# EAGLE design VIVA Blue Screen REV1 (EAGLE 6.3)

## Sheet 1 of 2
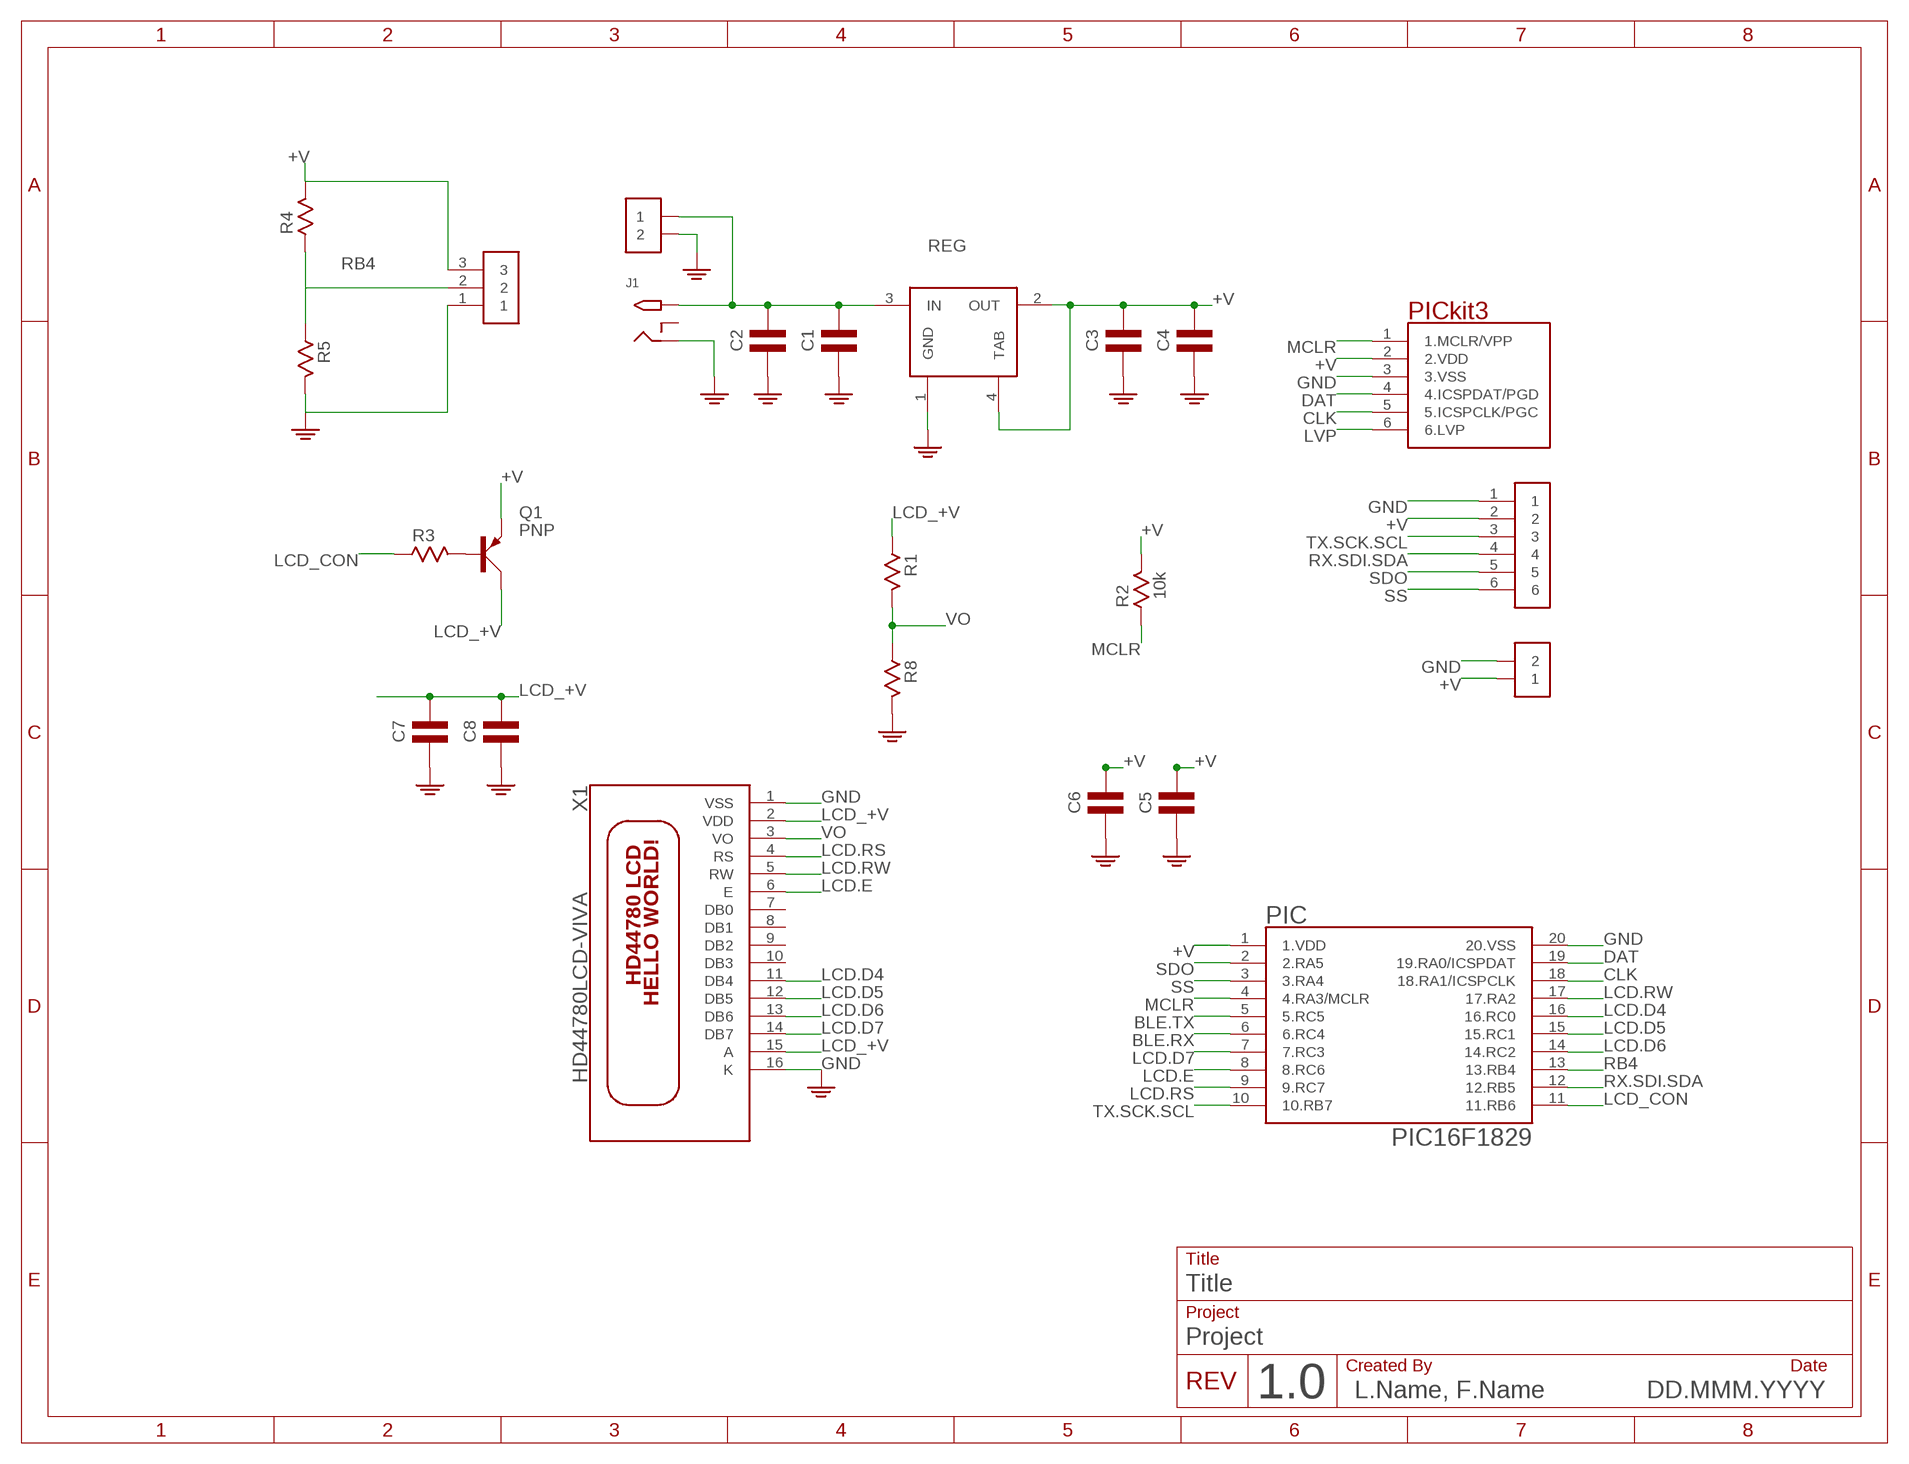
[diagram p0: schematic, sheet 1]

### Parts
C1  C0805  [C0805]
C2  C0805  [C0805]
C3  C0805  [C0805]
C4  C0805  [C0805]
C5  C0805  [C0805]
C6  C0805  [C0805]
C7  C0805  [C0805]
C8  C0805  [C0805]
J1  2.1MMJACKTHM  [PJ-102A]
J3  PICKIT3  [PINS_6_PICKIT3]
PIC  PIC16F1829  [SOP20-NEW]
Q1  PNP  2N3906SOT23  [SOT23]
R1  R0805  [R0805]
R2  10k  R0805  [R0805]
R3  R0805  [R0805]
R4  R0805  [R0805]
R5  R0805  [R0805]
R8  R0805  [R0805]
REG  REGULATOR_SCHSOT223  [SOT223]
U$1  PINS_3  [PINS_3]
U$2  PCB_2  [PCB_2]
U$3  PINS_6SQUARE  [PINS_6]
U$9  PCB_2  [PCB_2]
X1  HD44780LCD-VIVA  [LCD1602-VIVA]

### Nets
+V: C3.2 C4.2 C5.2 C6.2 J3.2(2.VDD) PIC.1(1.VDD) Q1.2(E) R2.2 R4.2 REG.2(OUT) REG.4(TAB) U$1.3 U$3.2 U$9.P$1 ; also sheet 2
BLE.RX: PIC.6(6.RC4) ; also sheet 2
BLE.TX: PIC.5(5.RC5) ; also sheet 2
CLK: J3.5(5.ICSPCLK/PGC) PIC.18(18.RA1/ICSPCLK)
DAT: J3.4(4.ICSPDAT/PGD) PIC.19(19.RA0/ICSPDAT)
GND: C1.1 C2.1 C3.1 C4.1 C5.1 C6.1 C7.1 C8.1 J1.RING J3.3(3.VSS) PIC.20(20.VSS) R5.2 R8.2 REG.1(GND) U$1.1 U$2.P$3 U$3.1 U$9.P$3 X1.1(VSS) X1.16(K) ; also sheet 2
LCD.D4: PIC.16(16.RC0) X1.11(DB4)
LCD.D5: PIC.15(15.RC1) X1.12(DB5)
LCD.D6: PIC.14(14.RC2) X1.13(DB6)
LCD.D7: PIC.7(7.RC3) X1.14(DB7)
LCD.E: PIC.8(8.RC6) X1.6(E)
LCD.RS: PIC.9(9.RC7) X1.4(RS)
LCD.RW: PIC.17(17.RA2) X1.5(RW)
LCD_+V: C7.2 C8.2 Q1.3(C) R1.1 X1.2(VDD) X1.15(A)
LCD_CON: PIC.11(11.RB6) R3.1
LVP: J3.6(6.LVP)
MCLR: J3.1(1.MCLR/VPP) PIC.4(4.RA3/MCLR) R2.1
N$2: C1.2 C2.2 J1.TIP REG.3(IN) U$2.P$1
N$4: Q1.1(B) R3.2
RB4: PIC.13(13.RB4) R4.1 R5.1 U$1.2
RX.SDI.SDA: PIC.12(12.RB5) U$3.4
SDO: PIC.2(2.RA5) U$3.5
SS: PIC.3(3.RA4) U$3.6
TX.SCK.SCL: PIC.10(10.RB7) U$3.3
VO: R1.2 R8.1 X1.3(VO)
Unconnected: J1.RING_SW X1.7(DB0) X1.8(DB1) X1.9(DB2) X1.10(DB3)

### Notes on the sheet
- Title
- Title
- Project
- Project
- Created By | Date
- DD.MMM.YYYY
- REV
- 1.0 | L.Name, F.Name

## Sheet 2 of 2
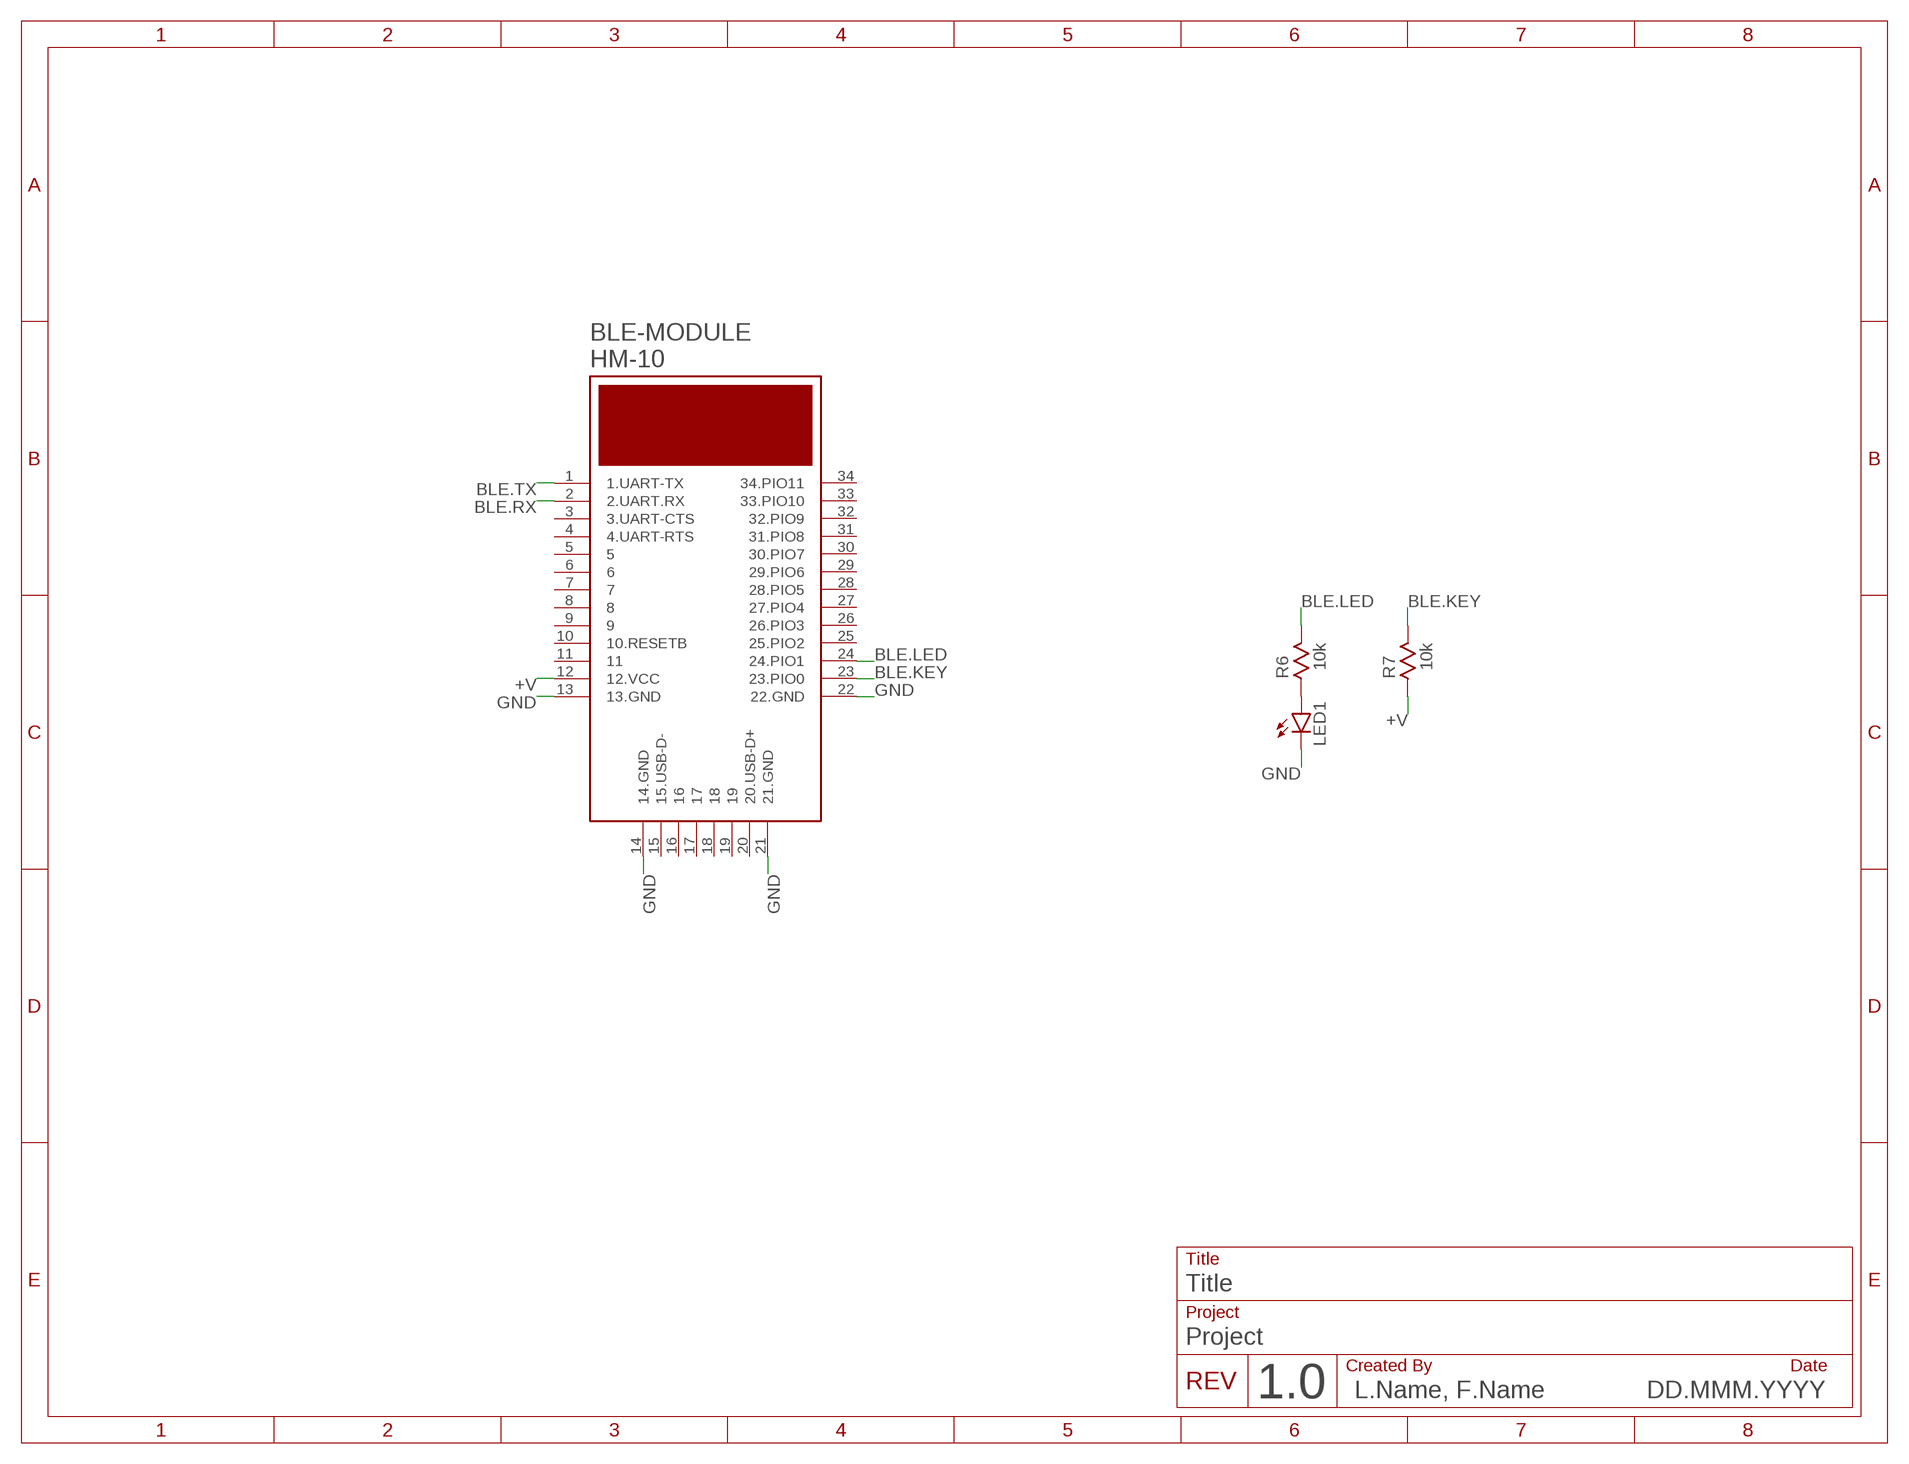
[diagram p1: schematic, sheet 2]

### Parts
BLE-MODULE  HM-10  HM-10SMD  [HM-10]
LED1  LEDCHIP-LED0805  [CHIP-LED0805]
R6  10k  R0805  [R0805]
R7  10k  R0805  [R0805]

### Nets
+V: BLE-MODULE.12(12.VCC) R7.1 ; also sheet 1
BLE.KEY: BLE-MODULE.23(23.PIO0) R7.2
BLE.LED: BLE-MODULE.24(24.PIO1) R6.2
BLE.RX: BLE-MODULE.2(2.UART.RX) ; also sheet 1
BLE.TX: BLE-MODULE.1(1.UART-TX) ; also sheet 1
GND: BLE-MODULE.13(13.GND) BLE-MODULE.14(14.GND) BLE-MODULE.21(21.GND) BLE-MODULE.22(22.GND) LED1.C ; also sheet 1
N$3: LED1.A R6.1
Unconnected: BLE-MODULE.3(3.UART-CTS) BLE-MODULE.4(4.UART-RTS) BLE-MODULE.5 BLE-MODULE.6 BLE-MODULE.7 BLE-MODULE.8 BLE-MODULE.9 BLE-MODULE.10(10.RESETB) BLE-MODULE.11 BLE-MODULE.15(15.USB-D-) BLE-MODULE.16 BLE-MODULE.17 BLE-MODULE.18 BLE-MODULE.19 BLE-MODULE.20(20.USB-D+) BLE-MODULE.25(25.PIO2) BLE-MODULE.26(26.PIO3) BLE-MODULE.27(27.PIO4) BLE-MODULE.28(28.PIO5) BLE-MODULE.29(29.PIO6) BLE-MODULE.30(30.PIO7) BLE-MODULE.31(31.PIO8) BLE-MODULE.32(32.PIO9) BLE-MODULE.33(33.PIO10) BLE-MODULE.34(34.PIO11)

### Notes on the sheet
- Title
- Title
- Project
- Project
- Created By | Date
- DD.MMM.YYYY
- REV
- 1.0 | L.Name, F.Name

## Library data of the parts
BLE-MODULE = nolan-utsa:HM-10
C1-C8 = nolan-utsa:C
J1 = nolan-utsa:2.1MMJACK: 2.1mm x 5.5mm THM DC jack with internal switch. Digikey part #PJ-102A, 4UCON part #05537 2.1mm x 5.5mm SMT DC jack with internal switch. Digikey part #PJ-002A-SMT, 4UCON part #03267 By microbuilder.eu & adafruit.com
J3 = nolan-utsa:PICKIT3
LED1 = nolan-utsa:LED: LED OSRAM: - CHIPLED LG R971, LG N971, LY N971, LG Q971, LY Q971, LO R971, LY R971 LH N974, LH R974 LS Q976, LO Q976, LY Q976 LO Q996 - Hyper CHIPLED LW Q18S LB Q993, LB Q99A, LB R99A - SideLED LS A670, LO A670, LY A670, LG A670, LP A670 LB A673, LV A673, LT A673, LW A673 LH A674 LY A675 LS A676, LA A676, LO A676, LY A676, LW A676 LS A679, LY A679, LG A679 - Hyper Micro SIDELED® LS Y876, LA Y876, LO Y876, LY Y876 LT Y87S - SmartLED LW L88C, LW L88S LB L89C, LB L89S, LG L890 LS L89K, LO L89K, LY L89K LS L896, LA L896, LO L896, LY L896 - TOPLED LS T670, LO T670, LY T670, LG T670, LP T670 LSG T670, LSP T670, LSY T670, LOP T670, LYG T670 LG T671, LOG T671, LSG T671 LB T673, LV T673, LT T673, LW T673 LH T674 LS T676, LA T676, LO T676, LY T676, LB T676, LH T676, LSB T676, LW T676 LB T67C, LV T67C, LT T67C, LS T67K, LO T67K, LY T67K, LW E67C LS E67B, LA E67B, LO E67B, LY E67B, LB E67C, LV E67C, LT E67C LW T67C LS T679, LY T679, LG T679 LS T770, LO T770, LY T770, LG T770, LP T770 LB T773, LV T773, LT T773, LW T773 LH T774 LS E675, LA E675, LY E675, LS T675 LS T776, LA T776, LO T776, LY T776, LB T776 LHGB T686 LT T68C, LB T68C - Hyper Mini TOPLED® LB M676 - Mini TOPLED Santana® LG M470 LS M47K, LO M47K, LY M47K Source: http://www.osram.convergy.de LUXEON: - LUMILED® LXK2-PW12-R00, LXK2-PW12-S00, LXK2-PW14-U00, LXK2-PW14-V00 LXK2-PM12-R00, LXK2-PM12-S00, LXK2-PM14-U00 LXK2-PE12-Q00, LXK2-PE12-R00, LXK2-PE12-S00, LXK2-PE14-T00, LXK2-PE14-U00 LXK2-PB12-K00, LXK2-PB12-L00, LXK2-PB12-M00, LXK2-PB14-N00, LXK2-PB14-P00, LXK2-PB14-Q00 LXK2-PR12-L00, LXK2-PR12-M00, LXK2-PR14-Q00, LXK2-PR14-R00 LXK2-PD12-Q00, LXK2-PD12-R00, LXK2-PD12-S00 LXK2-PH12-R00, LXK2-PH12-S00 LXK2-PL12-P00, LXK2-PL12-Q00, LXK2-PL12-R00 Source: www.luxeon.com KINGBRIGHT: KA-3528ASYC Source: www.kingbright.com
PIC = nolan-utsa:PIC16F1829
Q1 = nolan-utsa:2N3906: PNP TRANSISTOR
R1-R8 = nolan-utsa:R
REG = nolan-utsa:REGULATOR_SCH
U$1 = nolan-utsa:PINS_3
U$2 U$9 = nolan-utsa:PCB_2
U$3 = nolan-utsa:PINS_6
X1 = nolan-utsa:HD44780LCD: HD44780 LCD Standard character type LCDs, available in sizes from 8x1 to 40x4!

## Board
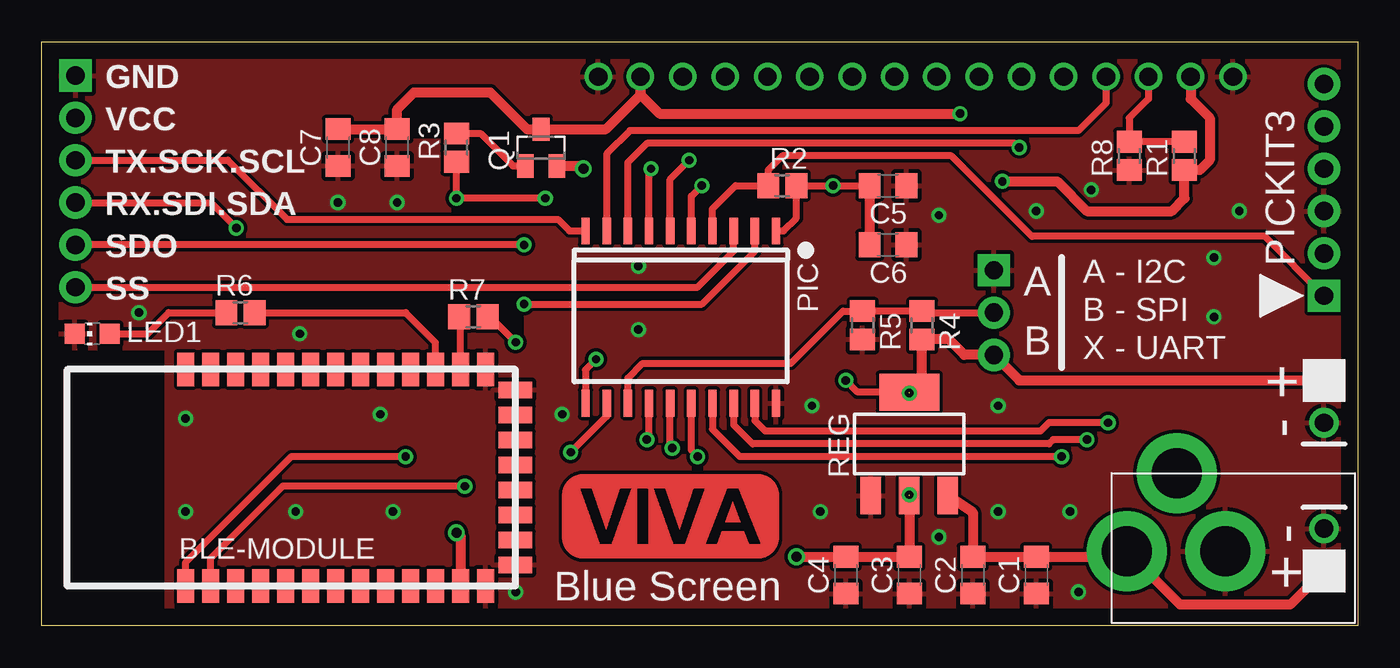
[diagram p2: board, top side]
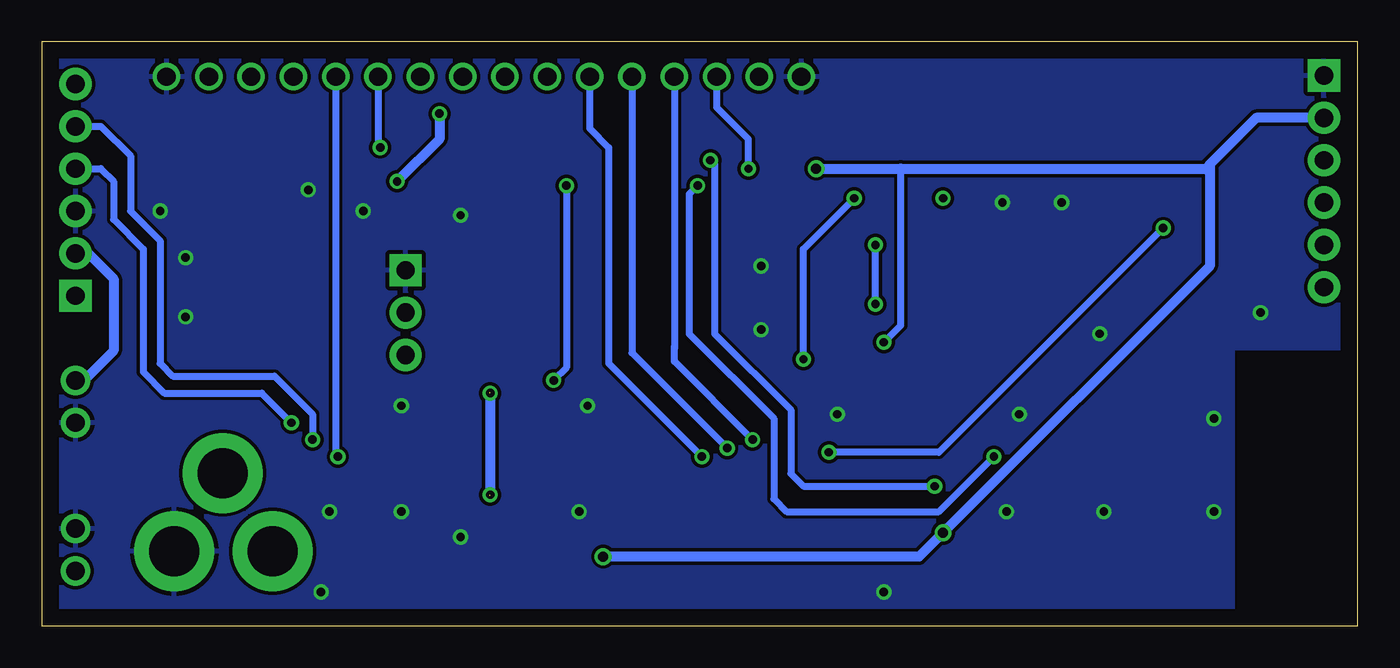
[diagram p3: board, bottom side, seen from below]

Size 78.99 x 35.05 mm. Coordinates in mm from the lower left corner, seen from the top.
Outline: 78.99,0 0,0 0,35.05 78.99,35.05 78.99,0
Copper layers (1*16): Top 0.035mm / dielectric 1.5mm / Bottom 0.035mm
Design rules "default *": minimum track width 10mil, minimum drill 24mil, track to track 8mil, track to pad 8mil, pad to pad 8mil, via to via 8mil, smd to smd 8mil, copper to edge 40mil, drill to drill 8mil, minimum pad ring 10mil, minimum via ring 8mil, stop-mask expansion 4mil, vias tented up to drill 20mil, thermal gap 10mil
tRestrict: 3 lines

### Footprints (pad centres in the part's own frame; a part is rotated, then mirrored left to right if it is on the bottom)
HM-10 = smd 2 x 1: 1 -6.5,6.34; 2 -6.5,4.84; 3 -6.5,3.34; 4 -6.5,1.84; 5 -6.5,0.34; 6 -6.5,-1.16; 7 -6.5,-2.66; 8 -6.5,-4.16; 9 -6.5,-5.66; 10 -6.5,-7.16; 11 -6.5,-8.66; 12 -6.5,-10.16; 13 -6.5,-11.66; 22 6.5,-11.66; 23 6.5,-10.16; 24 6.5,-8.66; 25 6.5,-7.16; 26 6.5,-5.66; 27 6.5,-4.16; 28 6.5,-2.66; 29 6.5,-1.16; 30 6.5,0.34; 31 6.5,1.84; 32 6.5,3.34; 33 6.5,4.84; 34 6.5,6.34 | smd 1 x 2: 14 -5.23,-13.45; 15 -3.73,-13.45; 16 -2.23,-13.45; 17 -0.73,-13.45; 18 0.77,-13.45; 19 2.27,-13.45; 20 3.77,-13.45; 21 5.27,-13.45
C0805 = smd 1.3 x 1.5: 1 -1.104,0; 2 1.104,0
PJ-102A = drill 3 pad 4.8: RING 0.1,-3.39; RING_SW -4.6,-6.29; TIP 0.1,-9.29
PINS_6_PICKIT3 = drill 1.1 pad 1.93 square: 1 0,0 | drill 1.1 pad 1.93: 2 0,-2.54; 3 0,-5.08; 4 0,-7.62; 5 0,-10.16; 6 0,-12.7
CHIP-LED0805 = smd 1.2 x 1.2: A 0,-1.05; C 0,1.05
SOP20-NEW = smd 0.5 x 1.6: 1 -5.715,-5.152; 2 -4.445,-5.152; 3 -3.175,-5.152; 4 -1.905,-5.152; 5 -0.635,-5.152; 6 0.635,-5.152; 7 1.905,-5.152; 8 3.175,-5.152; 9 4.445,-5.152; 10 5.715,-5.152; 11 5.715,5.188; 12 4.445,5.188; 13 3.175,5.188; 14 1.905,5.188; 15 0.635,5.188; 16 -0.635,5.188; 17 -1.905,5.188; 18 -3.175,5.188; 19 -4.445,5.188; 20 -5.715,5.188
SOT23 = smd 1 x 1.4: 1 -0.95,-1.1; 2 0.95,-1.1; 3 0,1.1
R0805 = smd 1.3 x 1.5: 1 -0.85,0; 2 0.85,0
SOT223 = smd 1.219 x 2.235: 1 -2.311,-3.099; 2 0,-3.099; 3 2.311,-3.099 | smd 3.6 x 2.2: 4 0,3.099
PINS_3 = drill 1.1 pad 1.93 square: 1 0,0 | drill 1.1 pad 1.93: 2 2.54,0; 3 5.08,0
PCB_2 = drill 1.1 pad 1.778: P$1 0,0; P$3 0,-2.54
PINS_6 = drill 1.1 pad 1.93 square: 1 0,0 | drill 1.1 pad 1.93: 2 2.54,0; 3 5.08,0; 4 7.62,0; 5 10.16,0; 6 12.7,0
LCD1602-VIVA = drill 1.1: 1 8,33.46; 2 10.54,33.46; 3 13.08,33.46; 4 15.62,33.46; 5 18.16,33.46; 6 20.7,33.46; 7 23.24,33.46; 8 25.78,33.46; 9 28.32,33.46; 10 30.86,33.46; 11 33.4,33.46; 12 35.94,33.46; 13 38.48,33.46; 14 41.02,33.46; 15 43.56,33.46; 16 46.1,33.46

### Placement (x,y rotation side)
BLE-MODULE  14.99,8.89 90 top
C1  59.69,3.05 90 top
C2  55.88,3.05 90 top
C3  52.07,3.05 90 top
C4  48.26,3.05 90 top
C5  50.8,26.42 180 top
C6  50.8,22.86 180 top
C7  17.78,28.7 90 top
C8  21.34,28.7 90 top
J1  74.42,4.57 270 top
J3  76.96,19.81 180 top
LED1  3.05,17.53 90 top
PIC  38.35,18.54 180 top
Q1  29.97,28.7 0 top
R1  68.58,28.19 90 top
R2  44.45,26.42 0 top
R3  24.89,28.7 90 top
R4  52.83,18.03 270 top
R5  49.28,18.03 270 top
R6  11.94,18.8 0 top
R7  25.91,18.54 180 top
R8  65.28,28.19 270 top
REG  52.07,10.92 0 top
U$1  57.15,21.34 270 top
U$2  76.96,3.3 180 top
U$3  2.03,33.02 270 top
U$4  [VIVA_LOGO]  31.24,4.06 0 top
U$9  76.96,14.73 0 top
X1  79.5,-0.51 0 bottom

### Tracks (layer width: path | path; a pad name or v marks a point on that pad's centre or on a via)
+V  (via drill 0.5, 0.6)  (2 unrouted)
  Top 0.406: REG.4 48.97,14.02 v48.26,14.73 | C5.2 v47.5,26.42 R2.2 45.3,24.47 44.52,23.69 PIC.1 | R7.1 26.92,18.54 v28.45,17.02
  Top 0.61: C5.2 C6.2 | REG.2 C3.2 C4.2 v45.3,4.15 | U$9.P$1 58.67,14.73 U$1.3 55.37,16.26 54.44,17.18 R4.2 52.83,14.78 REG.4 | v24.89,5.59 25.15,5.33 BLE-MODULE.12 | Q1.2 32.34,27.6 v32.51,27.43
  Bottom 0.406: v47.5,26.42 47.5,15.49 v48.26,14.73 | v28.45,17.02 27.43,18.03 27.43,27.43
  Bottom 0.61: J3.2 76.2,22.35 74.68,20.83 74.68,16.51 76.45,14.73 U$9.P$1 | U$3.2 6.1,30.48 8.89,27.69 8.89,27.18 | 8.89,27.18 8.89,21.59 v24.89,5.59 26.33,4.15 v45.3,4.15 | v32.51,27.43 27.43,27.43 9.14,27.43 8.89,27.18 | v52.07,13.97 v52.07,7.87
BLE.KEY
  Top 0.406: BLE-MODULE.23 25.15,18.45 R7.2
BLE.LED
  Top 0.406: R6.2 21.84,18.8 23.62,17.02 23.62,15.41 BLE-MODULE.24
BLE.RX  (via drill 0.5)
  Top 0.406: BLE-MODULE.2 10.15,4.05 14.48,8.38 v25.4,8.38 | PIC.6 37.72,26.8 v38.86,27.94
  Bottom 0.406: v38.86,27.94 38.61,27.69 38.61,17.53 34.04,12.95 34.04,9.14 33.27,8.38 v25.4,8.38
BLE.TX  (via drill 0.5)
  Top 0.406: BLE-MODULE.1 8.65,3.82 14.99,10.16 v21.84,10.16 | PIC.5 38.99,25.78 v39.62,26.42
  Bottom 0.406: v21.84,10.16 25.15,6.86 34.29,6.86 35.05,7.62 35.05,12.45 40.13,17.53 40.13,25.91 v39.62,26.42
CLK  (via drill 0.5)
  Top 0.406: v62.74,11.18 60.71,11.18 60.45,10.92 42.67,10.92 41.53,12.06 PIC.18
  Bottom 0.406: J3.5 75.44,29.97 73.66,28.19 73.66,24.89 71.88,23.11 71.88,15.75 71.12,14.99 65.02,14.99 62.74,12.7 v62.74,11.18
DAT  (via drill 0.5)
  Top 0.406: v64.01,12.19 60.45,12.19 59.94,11.68 43.43,11.68 42.8,12.32 PIC.19
  Bottom 0.406: J3.4 75.44,27.43 74.68,26.67 74.68,24.38 72.9,22.61 72.9,15.24 71.63,13.97 65.79,13.97 v64.01,12.19
GND  (via drill 0.5)
  other vias: 70.36,18.54 53.85,24.64 57.4,13.21 59.69,24.89 46.23,13.21 46.74,6.86 21.34,25.4 57.4,6.86 71.88,24.89 31.24,12.7 15.49,17.53 5.84,18.8 28.45,2.03 53.85,5.33 70.36,22.1 61.72,6.86 62.23,2.03 35.81,17.78 8.64,12.45 8.64,6.86 15.24,6.86 21.08,6.86 35.81,21.59 20.32,12.7 17.78,25.4 62.99,26.16
  pour Bottom: 78.99,0 0,0 0,35.05 78.99,35.05
  pour Top: 78.99,0 0,0 0,35.05 78.99,35.05
LCD.D4  (via drill 0.5)
  Top 0.406: v39.37,10.16 38.99,10.54 PIC.16
  Bottom 0.406: X1.11 46.1,29.85 44.96,28.7 44.96,15.75 v39.37,10.16
LCD.D5  (via drill 0.5)
  Top 0.406: v37.85,10.67 37.72,10.79 PIC.15
  Bottom 0.406: X1.12 43.56,16.38 v37.85,10.67
LCD.D6  (via drill 0.5)
  Top 0.406: v36.32,11.18 36.45,11.3 PIC.14
  Bottom 0.406: X1.13 41.02,16.76 41.02,16.64 41.02,15.88 v36.32,11.18
LCD.D7  (via drill 0.5)
  Top 0.406: PIC.7 36.45,27.05 v36.58,27.43
  Bottom 0.406: X1.14 38.48,31.12 36.58,29.21 v36.58,27.43
LCD.E  (via drill 0.5)
  Top 0.406: PIC.8 35.18,27.81 36.32,28.96 58.42,28.96 v58.67,28.7
  Bottom 0.406: X1.6 58.8,28.83 v58.67,28.7
LCD.RS
  Top 0.406: X1.4 63.88,31.37 62.23,29.72 35.31,29.72 33.91,28.32 PIC.9
LCD.RW  (via drill 0.5)
  Top 0.406: v61.21,10.16 41.91,10.16 40.26,11.81 PIC.17
  Bottom 0.406: X1.5 61.34,10.29 v61.21,10.16
LCD_+V  (via drill 0.5)
  Top 0.61: v55.12,30.73 37.08,30.73 35.94,31.88 X1.15 35.94,31.88 33.87,29.8 Q1.3 29.13,29.8 26.92,32 22.35,32 21.34,30.99 C8.2 C7.2 | v57.66,26.67 60.96,26.67 62.74,24.89 67.82,24.89 68.58,25.65 R1.1 69.51,27.34 70.1,27.94 70.1,30.48 68.96,31.62 X1.2
  Bottom 0.61: v55.12,30.73 55.12,29.21 v57.66,26.67
LCD_CON  (via drill 0.5)
  Top 0.406: R3.1 v24.89,25.65 v30.23,25.65 | v33.27,16 32.64,15.37 PIC.11
  Bottom 0.406: v33.27,16 33.27,22.61 v30.23,25.65
MCLR
  Top 0.406: J3.1 73.41,23.37 59.44,23.37 54.61,28.19 44.45,28.19 43.6,27.34 R2.1 41.66,26.42 40.26,25.02 PIC.4
N$2
  Top 0.61: REG.3 55.88,6.81 C2.2 C1.2 64.81,4.15 J1.TIP 68.33,1.27 74.93,1.27 U$2.P$1
N$3
  Top 0.406: LED1.A 6.35,17.53 7.62,18.8 R6.1
N$4
  Top 0.406: R3.2 26.33,29.55 28.28,27.6 Q1.1
RB4
  Top 0.406: U$1.2 52.92,18.8 R4.1 R5.1 48.09,18.88 44.96,15.75 36.07,15.75 35.18,14.86 PIC.13
RX.SDI.SDA  (via drill 0.5)
  Top 0.406: v31.75,10.41 33.91,12.57 PIC.12 | U$3.4 10.16,25.4 v11.68,23.88
  Bottom 0.406: v31.75,10.41 25.15,10.41 v11.68,23.88
SDO  (via drill 0.5)
  Top 0.406: v28.96,22.86 U$3.5 | v28.96,19.3 39.62,19.3 42.8,22.48 PIC.2
  Bottom 0.406: v28.96,19.3 v28.96,22.86
SS
  Top 0.406: U$3.6 39.37,20.32 41.53,22.48 PIC.3
TX.SCK.SCL
  Top 0.406: U$3.3 11.18,27.94 14.73,24.38 30.99,24.38 31.68,23.69 PIC.10 32.64,23.75
VO
  Top 0.406: R1.2 R8.1 65.28,30.48 66.42,31.62 X1.3

### Text on the board
tPlace: GND | VCC | TX.SCK.SCL | RX.SDI.SDA | SDO | A - I2C | SS | A | B - SPI | B | X - UART | + | - | - | Blue Screen | +